# EAGLE design GyroDriver (EAGLE 5.04)
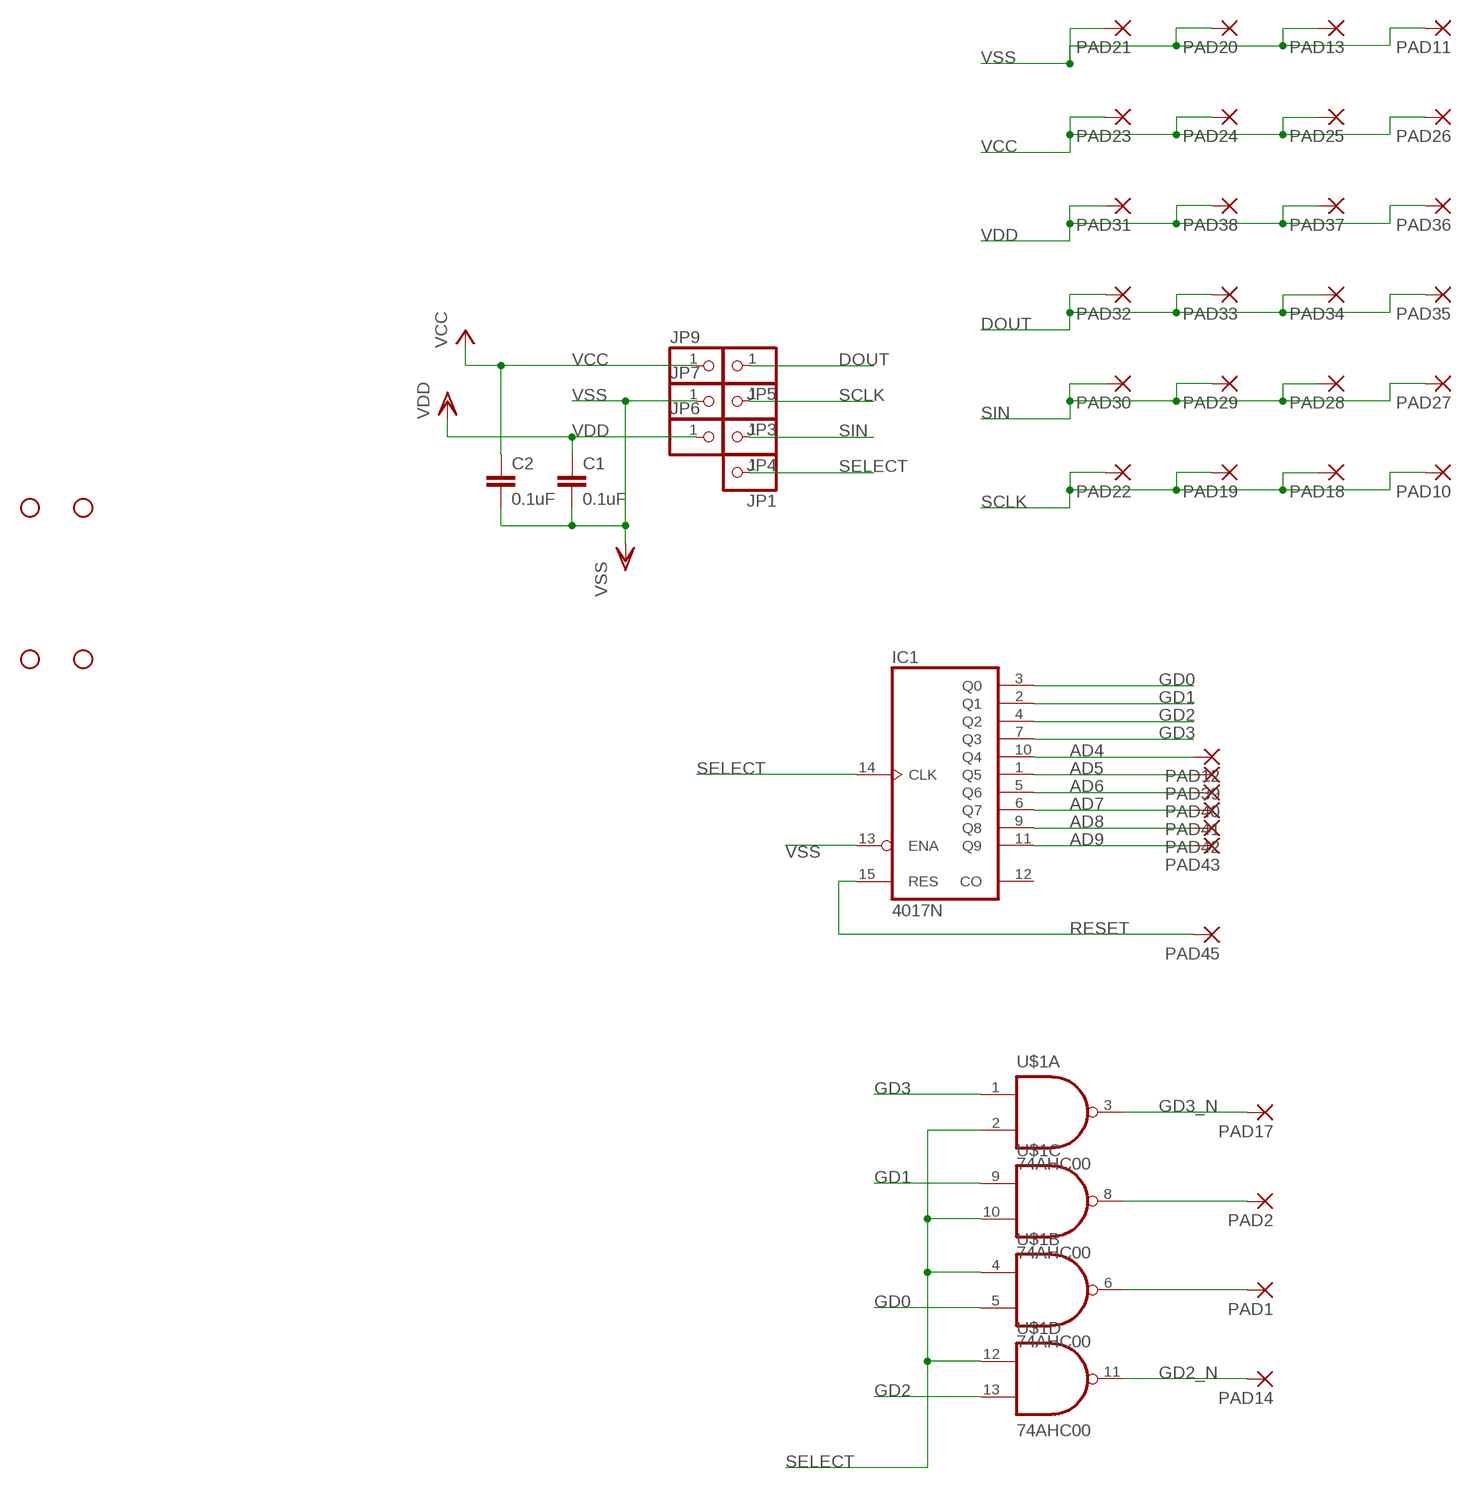
[diagram p0: schematic, sheet 1]

## Parts
C1  0.1uF  C-EUC2012  [C2012]
C2  0.1uF  C-EUC2012  [C2012]
IC1  4017N  [DIL16]
JP1  PINHD-1X1  [1X01]
JP3  PINHD-1X1  [1X01]
JP4  PINHD-1X1  [1X01]
JP5  PINHD-1X1  [1X01]
JP6  PINHD-1X1  [1X01]
JP7  PINHD-1X1  [1X01]
JP9  PINHD-1X1  [1X01]
PAD1  1,6/0,9  [1,6/0,9]
PAD2  1,6/0,9  [1,6/0,9]
PAD10  1,6/0,9  [1,6/0,9]
PAD11  1,6/0,9  [1,6/0,9]
PAD12  1,6/0,9  [1,6/0,9]
PAD13  1,6/0,9  [1,6/0,9]
PAD14  1,6/0,9  [1,6/0,9]
PAD17  1,6/0,9  [1,6/0,9]
PAD18  1,6/0,9  [1,6/0,9]
PAD19  1,6/0,9  [1,6/0,9]
PAD20  1,6/0,9  [1,6/0,9]
PAD21  1,6/0,9  [1,6/0,9]
PAD22  1,6/0,9  [1,6/0,9]
PAD23  1,6/0,9  [1,6/0,9]
PAD24  1,6/0,9  [1,6/0,9]
PAD25  1,6/0,9  [1,6/0,9]
PAD26  1,6/0,9  [1,6/0,9]
PAD27  1,6/0,9  [1,6/0,9]
PAD28  1,6/0,9  [1,6/0,9]
PAD29  1,6/0,9  [1,6/0,9]
PAD30  1,6/0,9  [1,6/0,9]
PAD31  1,6/0,9  [1,6/0,9]
PAD32  1,6/0,9  [1,6/0,9]
PAD33  1,6/0,9  [1,6/0,9]
PAD34  1,6/0,9  [1,6/0,9]
PAD35  1,6/0,9  [1,6/0,9]
PAD36  1,6/0,9  [1,6/0,9]
PAD37  1,6/0,9  [1,6/0,9]
PAD38  1,6/0,9  [1,6/0,9]
PAD39  1,6/0,9  [1,6/0,9]
PAD40  1,6/0,9  [1,6/0,9]
PAD41  1,6/0,9  [1,6/0,9]
PAD42  1,6/0,9  [1,6/0,9]
PAD43  1,6/0,9  [1,6/0,9]
PAD45  1,6/0,9  [1,6/0,9]
U$1  74AHC00  [TSSOP14-PW]
U$2  STAND-OFF  [STAND-OFF]
U$3  STAND-OFF  [STAND-OFF]
U$5  STAND-OFF  [STAND-OFF]
U$6  STAND-OFF  [STAND-OFF]

## Nets
AD4: IC1.10(Q4) PAD12.1(P)
AD5: IC1.1(Q5) PAD39.1(P)
AD6: IC1.5(Q6) PAD40.1(P)
AD7: IC1.6(Q7) PAD41.1(P)
AD8: IC1.9(Q8) PAD42.1(P)
AD9: IC1.11(Q9) PAD43.1(P)
DOUT: JP5.1 PAD32.1(P) PAD33.1(P) PAD34.1(P) PAD35.1(P)
GD0: IC1.3(Q0) U$1.5(B:B)
GD1: IC1.2(Q1) U$1.9(C:A)
GD2: IC1.4(Q2) U$1.13(D:B)
GD2_N: PAD14.1(P) U$1.11(D:OUT)
GD3: IC1.7(Q3) U$1.1(A:A)
GD3_N: PAD17.1(P) U$1.3(A:OUT)
N$3: PAD1.1(P) U$1.6(B:OUT)
N$5: PAD2.1(P) U$1.8(C:OUT)
RESET: IC1.15(RES) PAD45.1(P)
SCLK: JP3.1 PAD10.1(P) PAD18.1(P) PAD19.1(P) PAD22.1(P)
SELECT: IC1.14(CLK) JP1.1 U$1.2(A:B) U$1.4(B:A) U$1.10(C:B) U$1.12(D:A)
SIN: JP4.1 PAD27.1(P) PAD28.1(P) PAD29.1(P) PAD30.1(P)
VCC: C2.1 JP9.1 PAD23.1(P) PAD24.1(P) PAD25.1(P) PAD26.1(P)
VDD [VDD]: C1.1 JP6.1 PAD31.1(P) PAD36.1(P) PAD37.1(P) PAD38.1(P)
VSS [VSS]: C1.2 C2.2 IC1.13(ENA) JP7.1 PAD11.1(P) PAD13.1(P) PAD20.1(P) PAD21.1(P)
Unconnected: IC1.12(CO)

## Power pins joined to a net without a drawn wire
VCC: U$1.14(PWR:VCC)
VDD: IC1.16(VDD)
VSS: IC1.8(VSS) U$1.7(PWR:VSS)

## Library data of the parts
C1 C2 = rcl:C-EU: CAPACITOR, European symbol
IC1 = 40xx:4017: COUNTER/DIVIDER
JP1 JP3-JP7 JP9 = pinhead:PINHD-1X1: PIN HEADER
PAD1 PAD2 PAD10-PAD14 PAD17-PAD43 PAD45 = wirepad:1,6/0,9: THROUGH-HOLE PAD
U$1 = 74ah:74AHC00
U$2 U$3 U$5 U$6 = SparkFun:STAND-OFF: Stand Off This is the mechanical footprint for a #4 phillips button head screw. Use the keepout ring to avoid running the screw head into surrounding components. SKU : PRT-00447

## Board
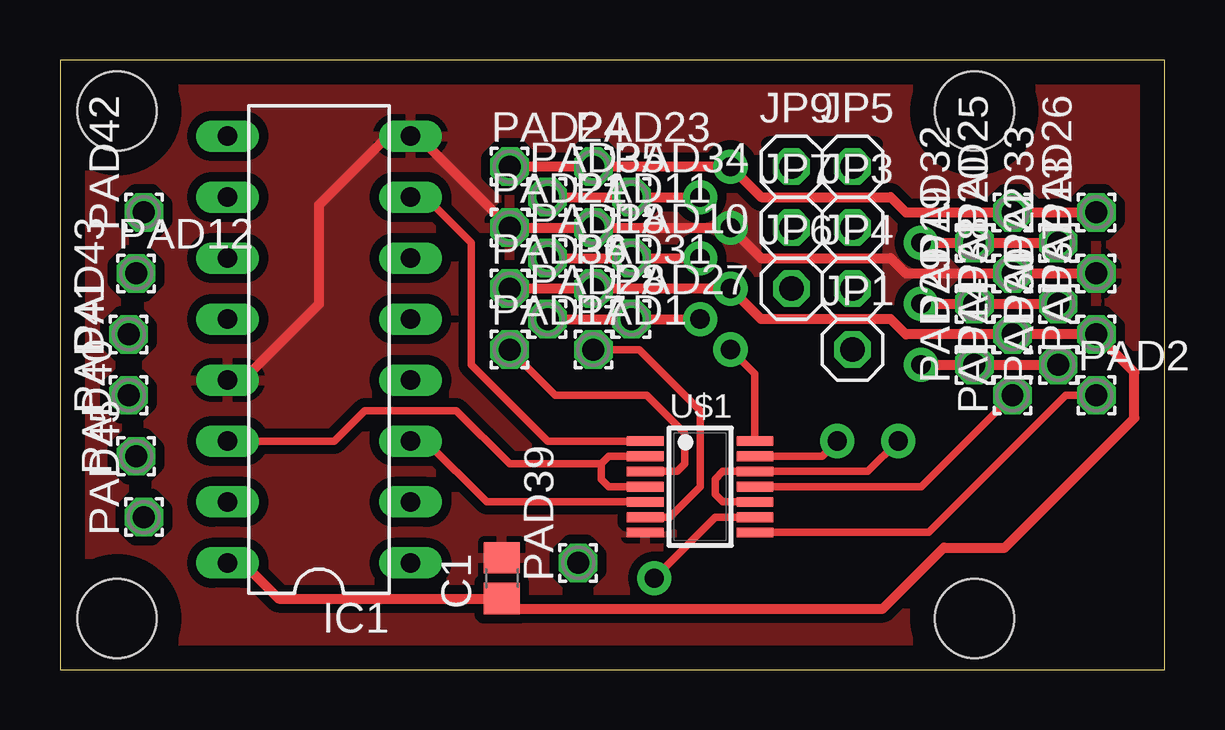
[diagram p1: board, top side]
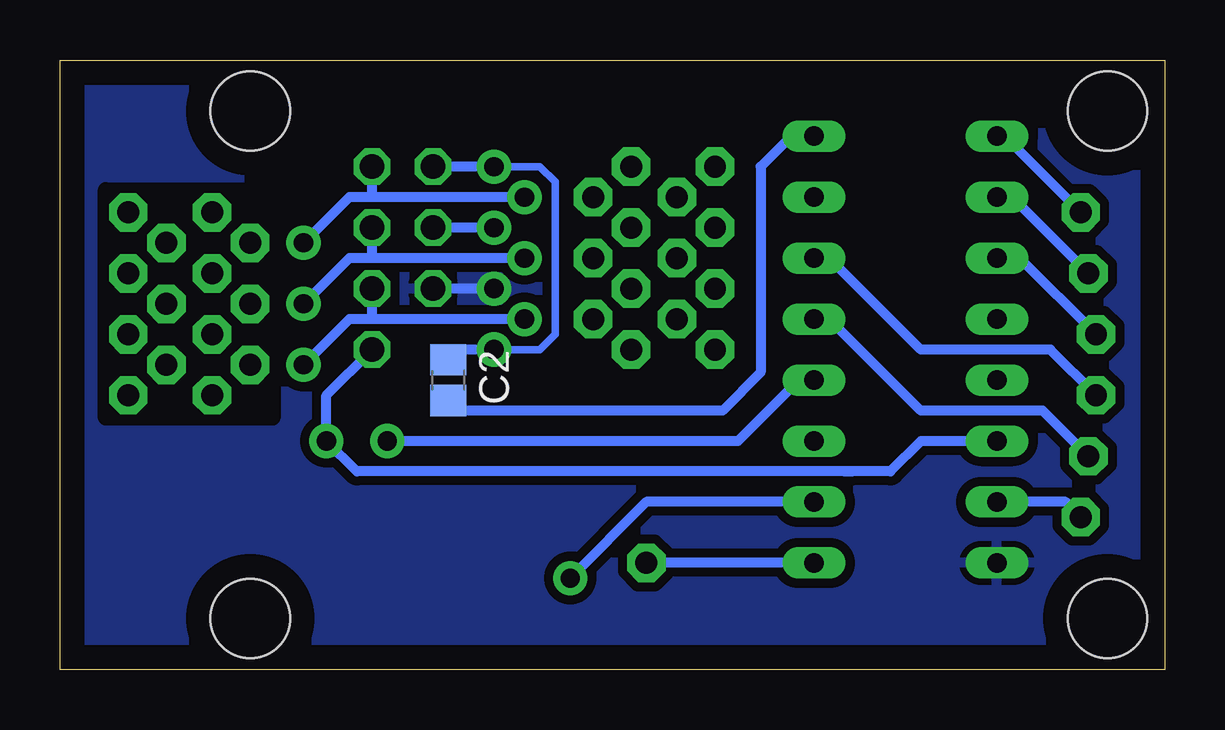
[diagram p2: board, bottom side, seen from below]

Size 46.02 x 25.4 mm. Coordinates in mm from the lower left corner, seen from the top.
Outline: 0,0 46.02,0 46.02,25.4 0,25.4 0,0
Copper layers (1*16): Top 0.035mm / dielectric 1.5mm / Bottom 0.035mm
Design rules "default *": minimum track width 12mil, minimum drill 0.8mm, track to track 15mil, track to pad 15mil, pad to pad 15mil, via to via 15mil, smd to smd 15mil, copper to edge 40mil, drill to drill 8mil, minimum pad ring 10mil, minimum via ring 8mil, stop-mask expansion 4mil, vias tented up to drill 0mil, thermal gap 10mil
tRestrict: area 29.5,14.9 to 34,21.9; area 31.8,12.4 to 34,14.9
bRestrict: area 37.1,10.5 to 44.1,20; area 17.8,12.4 to 24.8,21.9

### Footprints (pad centres in the part's own frame; a part is rotated, then mirrored left to right if it is on the bottom)
C2012 = smd 1.3 x 1.5: 1 -0.85,0; 2 0.85,0
DIL16 = drill 0.813 long: 1 -8.89,-3.81; 2 -6.35,-3.81; 3 -3.81,-3.81; 4 -1.27,-3.81; 5 1.27,-3.81; 6 3.81,-3.81; 7 6.35,-3.81; 8 8.89,-3.81; 9 8.89,3.81; 10 6.35,3.81; 11 3.81,3.81; 12 1.27,3.81; 13 -1.27,3.81; 14 -3.81,3.81; 15 -6.35,3.81; 16 -8.89,3.81
1X01 = drill 1.016 octagon: 1 0,0
1,6/0,9 = drill 0.914 pad 1.6 octagon: 1 0,0
TSSOP14-PW = smd 0.406 x 1.524: 1 -1.905,-2.286; 2 -1.27,-2.286; 3 -0.635,-2.286; 4 0,-2.286; 5 0.635,-2.286; 6 1.27,-2.286; 7 1.905,-2.286; 8 1.905,2.286; 9 1.27,2.286; 10 0.635,2.286; 11 0,2.286; 12 -0.635,2.286; 13 -1.27,2.286; 14 -1.905,2.286
STAND-OFF = hole 3.302: 0,0

### Placement (x,y rotation side)
C1  18.41,3.81 90 top
C2  29.84,12.06 270 bottom
IC1  10.79,13.34 90 top
JP1  33.02,13.34 0 top
JP3  33.02,18.41 0 top
JP4  33.02,15.88 0 top
JP5  33.02,20.95 0 top
JP6  30.48,15.88 0 top
JP7  30.48,18.41 0 top
JP9  30.48,20.95 0 top
PAD1  22.23,13.34 0 top
PAD2  43.18,11.43 0 top
PAD10  23.81,17.14 0 top
PAD11  22.23,18.41 0 top
PAD12  3.17,16.51 0 top
PAD13  43.18,16.51 90 top
PAD14  39.69,11.43 90 top
PAD17  18.73,13.34 0 top
PAD18  20.32,17.14 0 top
PAD19  38.1,15.24 90 top
PAD20  39.69,16.51 90 top
PAD21  18.73,18.41 0 top
PAD22  41.59,15.24 90 top
PAD23  22.23,20.95 0 top
PAD24  18.73,20.95 0 top
PAD25  39.69,19.05 90 top
PAD26  43.18,19.05 90 top
PAD27  23.81,14.61 0 top
PAD28  20.32,14.61 0 top
PAD29  38.1,12.7 90 top
PAD30  41.59,12.7 90 top
PAD31  22.23,15.88 0 top
PAD32  38.1,17.78 90 top
PAD33  41.59,17.78 90 top
PAD34  23.81,19.68 0 top
PAD35  20.32,19.68 0 top
PAD36  18.73,15.88 0 top
PAD37  43.18,13.97 90 top
PAD38  39.69,13.97 90 top
PAD39  21.59,4.45 90 top
PAD40  3.17,8.89 90 top
PAD41  2.86,11.43 90 top
PAD42  3.49,19.05 90 top
PAD43  2.86,13.97 90 top
PAD45  3.49,6.35 90 top
U$1  26.67,7.62 270 top
U$2  2.38,2.13 0 top
U$3  38.1,2.13 0 top
U$5  2.38,23.27 0 top
U$6  38.1,23.27 0 top

### Tracks (layer width: path | path; a pad name or v marks a point on that pad's centre or on a via)
AD4
  Bottom 0.406: IC1.10 6.35,19.68 PAD12.1
AD5
  Bottom 0.406: IC1.1 PAD39.1
AD6
  Bottom 0.406: IC1.5 13.97,14.61 10.16,10.79 5.08,10.79 PAD40.1
AD7
  Bottom 0.406: IC1.6 13.97,17.14 10.16,13.34 4.76,13.34 PAD41.1
AD8
  Bottom 0.406: PAD42.1 6.67,22.23 IC1.9
AD9
  Bottom 0.406: PAD43.1 6.03,17.14 IC1.11
DOUT  (via drill 0.8 pad 1.42)
  Top 0.406: v26.67,19.68 PAD34.1 PAD35.1 | PAD33.1 PAD32.1 v35.88,17.78
  Bottom 0.406: v26.67,19.68 33.02,19.68 | 33.02,19.68 33.97,19.68 v35.88,17.78 | 33.02,19.68 JP5.1
GD0
  Top 0.305: IC1.3 15.24,9.53 17.78,6.99 U$1.5
GD1  (via drill 0.8 pad 1.42)
  Top 0.305: v24.77,3.81 27.3,6.35 U$1.9
  Bottom 0.406: v24.77,3.81 21.59,6.99 IC1.2
GD2  (via drill 0.8 pad 1.42)
  Top 0.305: v32.38,9.53 31.75,8.89 U$1.13
  Bottom 0.406: v32.38,9.53 17.78,9.53 15.24,12.06 IC1.4
GD2_N
  Top 0.305: PAD14.1 35.88,7.62 U$1.11
GD3
  Top 0.305: IC1.7 15.24,19.68 17.14,17.78 17.14,12.7 20.32,9.53 U$1.1
GD3_N
  Top 0.305: PAD17.1 20.64,11.43 24.45,11.43 26.04,9.84 26.04,8.57 25.72,8.26 U$1.3
N$3
  Top 0.305: U$1.6 25.4,6.35 26.67,7.62 26.67,10.79 24.13,13.34 PAD1.1
N$5
  Top 0.305: PAD2.1 41.91,11.43 36.2,5.71 U$1.8
RESET
  Bottom 0.406: IC1.15 4.13,6.99 PAD45.1
SCLK  (via drill 0.8 pad 1.42)
  Top 0.406: PAD22.1 PAD19.1 v35.88,15.24 | v26.67,17.14 PAD10.1 PAD18.1
  Bottom 0.406: v26.67,17.14 33.02,17.14 | 33.02,17.14 JP3.1 | v35.88,15.24 33.97,17.14 33.02,17.14
SELECT  (via drill 0.8 pad 1.42)
  Top 0.305: IC1.14 11.43,9.53 12.7,10.79 16.51,10.79 18.73,8.57 22.54,8.57 | v34.92,9.53 33.66,8.26 U$1.12 27.62,8.26 27.3,7.94 27.3,7.3 27.62,6.99 U$1.10 | 22.54,8.57 22.86,8.89 U$1.2 | 22.54,8.57 22.54,7.94 22.86,7.62 U$1.4
  Bottom 0.406: 13.34,8.26 13.02,8.26 | 13.34,8.26 33.66,8.26 v34.92,9.53 34.92,11.43 JP1.1 | IC1.14 10.16,9.53 11.43,8.26 13.34,8.26
SIN  (via drill 0.8 pad 1.42)
  Top 0.406: PAD30.1 PAD29.1 v35.88,12.7 | v26.67,14.61 PAD27.1 PAD28.1
  Bottom 0.406: v26.67,14.61 33.02,14.61 | 33.02,14.61 33.97,14.61 v35.88,12.7 | 33.02,14.61 JP4.1
VCC  (via drill 0.8 pad 1.42)
  Top 0.305: v27.94,13.34 28.96,12.32 U$1.14
  Top 0.406: PAD24.1 PAD23.1 v27.94,20.95 29.21,19.68 34.61,19.68 35.24,19.05 PAD25.1 PAD26.1
  Bottom 0.305: v27.94,20.95 26.04,20.95 25.4,20.32 25.4,13.97 26.04,13.34 v27.94,13.34
  Bottom 0.406: v27.94,20.95 JP9.1 | v27.94,13.34 29.84,13.34 C2.1
VDD  (via drill 0.8 pad 1.42)
  Top 0.406: PAD36.1 PAD31.1 v27.94,15.88 29.21,14.61 34.61,14.61 35.24,13.97 PAD38.1 PAD37.1 44.77,12.38 44.77,10.48 39.37,5.08 36.83,5.08 34.29,2.54 18.41,2.54 C1.1 9.11,2.96 7.62,4.45 IC1.16
  Bottom 0.406: v27.94,15.88 JP6.1
  pour Bottom (isolate 0.317): 0,0 0,25.4 46.02,25.4 46.02,0
VSS  (via drill 0.8 pad 1.42)
  Top 0.406: PAD13.1 PAD20.1 35.24,16.51 34.61,17.14 29.21,17.14 v27.94,18.41 PAD11.1 PAD21.1 14.92,22.23 IC1.8 13.65,22.23 10.79,19.37 10.79,15.24 7.62,12.06 IC1.13
  Bottom 0.406: v27.94,18.41 JP7.1 | C2.2 29.43,10.79 18.41,10.79 16.83,12.38 16.83,20.95 15.56,22.23 IC1.8
  pour Top (isolate 0.317): 0,25.4 46.02,25.4 46.02,0 0,0